# EAGLE design expansion_module_ARDUINO_UNO (EAGLE 9.6.2)
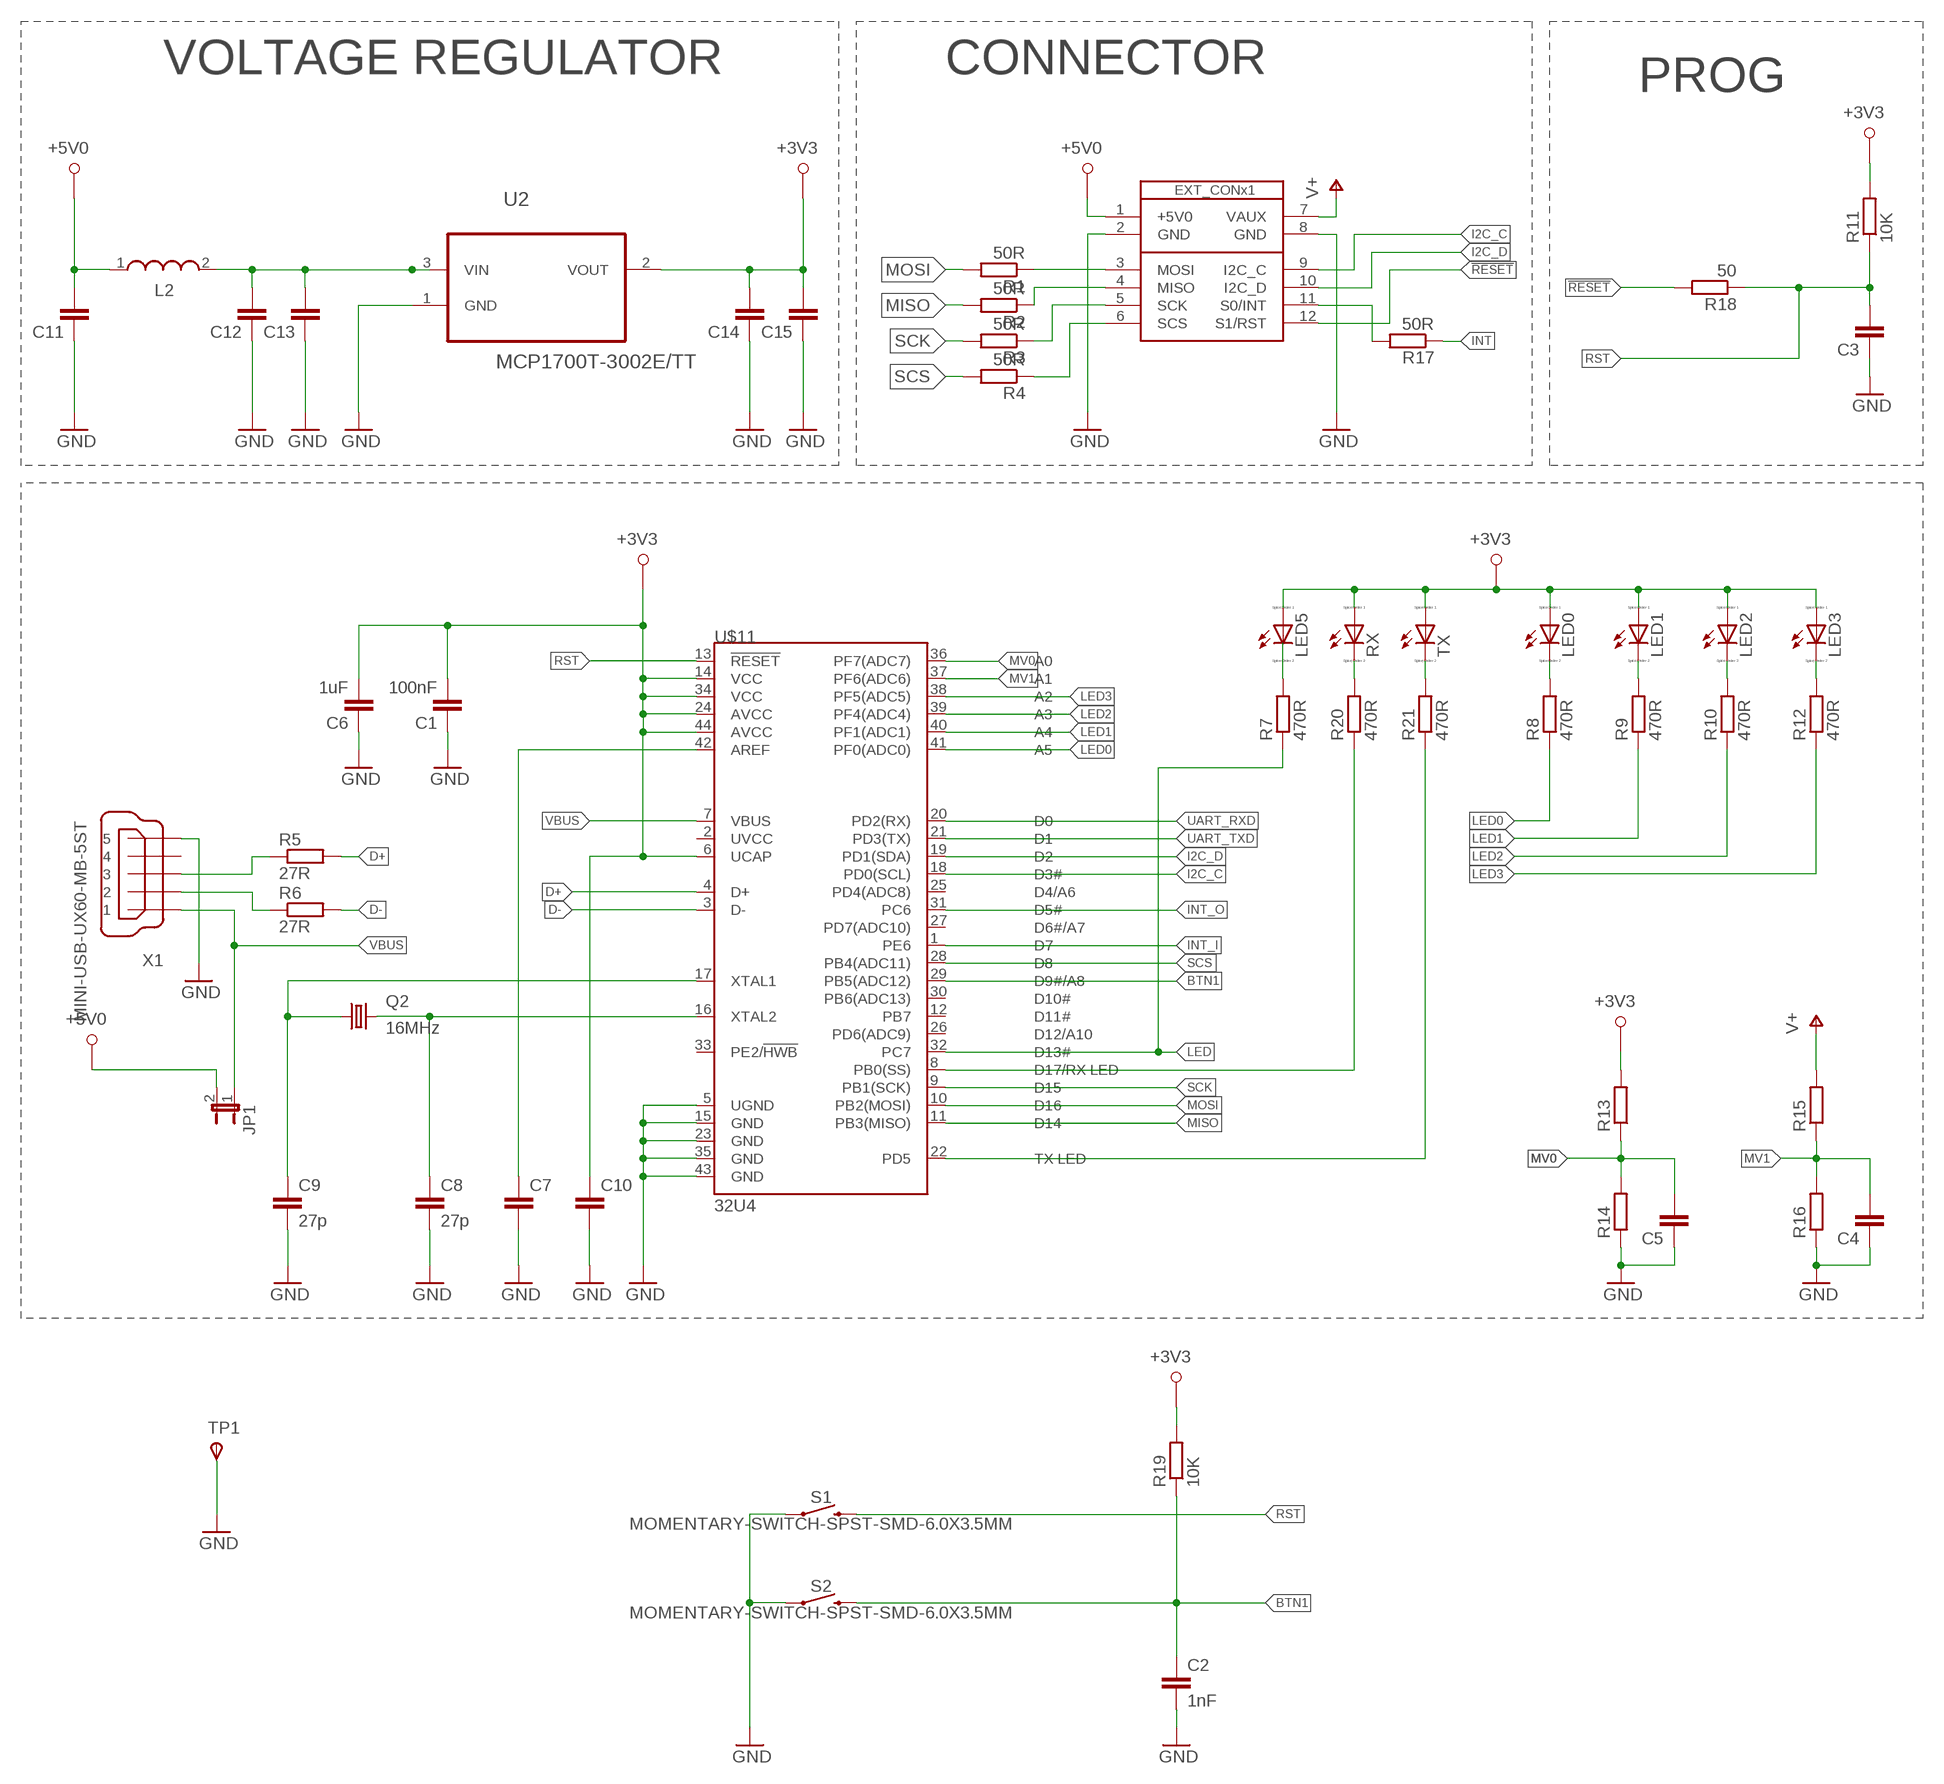
[diagram p0: schematic, sheet 1]

## Parts
C1  100nF  C-EUC0603  [C0603]
C2  1nF  C-EUC0603K  [C0603K]
C3  C-EUC0603  [C0603]
C4  C-EUC0603  [C0603]
C5  C-EUC0603  [C0603]
C6  1uF  C-EUC0603  [C0603]
C7  C-EUC0603K  [C0603K]
C8  27p  C-EUC0603K  [C0603K]
C9  27p  C-EUC0603K  [C0603K]
C10  C-EUC0603K  [C0603K]
C11  C-EUC0603  [C0603]
C12  C-EUC0603  [C0603]
C13  C-EUC0603  [C0603]
C14  C-EUC0603  [C0603]
C15  C-EUC0603  [C0603]
JP1  JP1E  [JP1]
L2  WE-LQ_1210  [WE-LQ_M]
LED0  LED_ESML0603  [LED_SML0603]
LED1  LED_ESML0603  [LED_SML0603]
LED2  LED_ESML0603  [LED_SML0603]
LED3  LED_ESML0603  [LED_SML0603]
LED5  LED_ESML0603  [LED_SML0603]
Q2  16MHz  KX-9A  [5.0X3.2_KX-9A]
R1  50R  R-EU_R0603  [R0603]
R2  50R  R-EU_R0603  [R0603]
R3  50R  R-EU_R0603  [R0603]
R4  50R  R-EU_R0603  [R0603]
R5  27R  R-EU_R0603  [R0603]
R6  27R  R-EU_R0603  [R0603]
R7  470R  R-EU_R0603  [R0603]
R8  470R  R-EU_R0603  [R0603]
R9  470R  R-EU_R0603  [R0603]
R10  470R  R-EU_R0603  [R0603]
R11  10K  R-EU_R0603  [R0603]
R12  470R  R-EU_R0603  [R0603]
R13  R-EU_R0603  [R0603]
R14  R-EU_R0603  [R0603]
R15  R-EU_R0603  [R0603]
R16  R-EU_R0603  [R0603]
R17  50R  R-EU_R0603  [R0603]
R18  50  R-EU_R0603  [R0603]
R19  10K  R-EU_R0603  [R0603]
R20  470R  R-EU_R0603  [R0603]
R21  470R  R-EU_R0603  [R0603]
RX  LED_ESML0603  [LED_SML0603]
S1  MOMENTARY-SWITCH-SPST-SMD-6.0X3.5MM  [TACTILE_SWITCH_SMD_6.0X3.5MM]
S2  MOMENTARY-SWITCH-SPST-SMD-6.0X3.5MM  [TACTILE_SWITCH_SMD_6.0X3.5MM]
TP1  TPSPAD1-13  [P1-13]
TX  LED_ESML0603  [LED_SML0603]
U2  MCP1700T-3002E/TT  [SOT95P237X112-3N]
U$1  SB_EXT_CON_X1_SPI  [SB_EXT_CON_X1_FULL]
U$11  32U4  ATMEGA32U4TQFP-44  [TQFP44]
X1  MINI-USB-UX60-MB-5ST  [UX60-MB-5ST]

## Nets
!RESET: R18.2 U$1.12(S1/RST)
+3V3: C1.2 C6.2 C10.1 C14.2 C15.2 LED0.A LED1.A LED2.A LED3.A LED5.A R11.2 R13.2 R19.2 RX.A TX.A U2.2(VOUT) U$11.6(UCAP) U$11.14(VCC) U$11.24(AVCC) U$11.34(VCC) U$11.44(AVCC)
+5V0: C11.2 JP1.2 L2.1 U$1.1(+5V0)
BTN1: C2.1 R19.1 S2.2 U$11.29(PB5(ADC12))
D+: R5.2 U$11.4(D+)
D-: R6.2 U$11.3(D-)
GND: C1.1 C2.2 C3.1 C4.1 C5.1 C6.1 C7.2 C8.2 C9.2 C10.2 C11.1 C12.1 C13.1 C14.1 C15.1 R14.1 R16.1 S1.1 S2.1 TP1.TP(PP) U2.1(GND) U$1.2(GND) U$1.8(GND) U$11.5(UGND) U$11.15(GND) U$11.23(GND) U$11.35(GND) U$11.43(GND) X1.5
I2C_C: U$1.9(I2C_C) U$11.18(PD0(SCL))
I2C_D: U$1.10(I2C_D) U$11.19(PD1(SDA))
INT: R17.1
INT_I: U$11.1(PE6)
INT_O: U$11.31(PC6)
LED: R7.1 U$11.32(PC7)
LED0: R8.1 U$11.41(PF0(ADC0))
LED1: R9.1 U$11.40(PF1(ADC1))
LED2: R10.1 U$11.39(PF4(ADC4))
LED3: R12.1 U$11.38(PF5(ADC5))
MISO: R2.2 U$11.11(PB3(MISO))
MOSI: R1.2 U$11.10(PB2(MOSI))
MV0: C5.2 R13.1 R14.2 U$11.36(PF7(ADC7))
MV1: C4.2 R15.1 R16.2 U$11.37(PF6(ADC6))
N$1: R1.1 U$1.3(MOSI)
N$2: R2.1 U$1.4(MISO)
N$3: R3.1 U$1.5(SCK)
N$4: R4.1 U$1.6(SCS)
N$5: LED5.C R7.2
N$7: C7.1 U$11.42(AREF)
N$8: R20.1 U$11.8(PB0(SS))
N$9: C9.1 Q2.1 U$11.17(XTAL1)
N$11: C8.1 Q2.3 U$11.16(XTAL2)
N$12: LED0.C R8.2
N$18: LED1.C R9.2
N$19: R6.1 X1.2
N$20: R5.1 X1.3
N$21: LED2.C R10.2
N$22: LED3.C R12.2
N$23: R21.1 U$11.22(PD5)
N$24: R21.2 TX.C
N$25: R20.2 RX.C
N$26: C12.2 C13.2 L2.2 U2.3(VIN)
N$27: R17.2 U$1.11(S0/INT)
RST: C3.2 R11.1 R18.1 S1.2 U$11.13(!RESET)
SCK: R3.2 U$11.9(PB1(SCK))
SCS: R4.2 U$11.28(PB4(ADC11))
UART_RXD: U$11.20(PD2(RX))
UART_TXD: U$11.21(PD3(TX))
V+: R15.2 U$1.7(VAUX)
VBUS: JP1.1 U$11.7(VBUS) X1.1
Unconnected: U$11.2(UVCC) U$11.12(PB7) U$11.25(PD4(ADC8)) U$11.26(PD6(ADC9)) U$11.27(PD7(ADC10)) U$11.30(PB6(ADC13)) U$11.33(PE2/!HWB) X1.4

## Notes on the sheet
- VOLTAGE REGULATOR | CONNECTOR
- PROG

## Library data of the parts
C1 C3-C6 C11-C15 = resistor:C-EU: CAPACITOR, European symbol
C2 C7-C10 = rcl:C-EU: CAPACITOR, European symbol
JP1 = jumper:JP1E: JUMPER
L2 = EagleLibrary_Wuerth_Elektronik_eiSos_rev16a:WE-LQ: SMD Inductor Characteristics Miniature chip inductor wound on a special ferrite core Small inductances for compact circuits High Q at high frequencies Low DC-resistance Operating temperature: –40 ºC to +125 ºC Applications Low power DC/DC-converters from Linear Technology, National Semiconductor, Texas Instruments, Fairchild Semiconductor, ON Semiconductor, STMicroelectronics, Maxim, MPS, Semtech, Exar, Analogic Tech, Diodes and Cologne Chip EMI-Filtering RF-circuits <http://katalog.we-online.de/media/images/eisos/IndLQ_pf2.jpg> Details see: http://katalog.we-online.de/en/pbs/WE-LQ? Updated by Dan Xu 2014-07-08 2014 (C) Wurth Elektronik
LED0 LED1-LED3 LED5 RX TX = eagle-ltspice:LED_E: LED Source: http://www.osram.convergy.de Source: www.luxeon.com Source: www.kingbright.com; SPICEMODEL: NONE; SPICEPREFIX: D; SPICETYPE: diode
Q2 = crystal-geyer_V1_0:KX: Quartz Crystals (MHz) SMD: KX - Serie Model Size l/w/h [mm] Frequency Range Frequency Stability Temp. Range [°C] Load Capacitance AECQ 200 availabel Datasheet KX-4 KX-5 KX-6 KX-7 KX-9A KX-9B KX-12A KX-12B KX-13 KX-20 KX-K KX-KS 1.6/1.2/0.3 2.0/1.6/0.45 2.5/2.0/0.55 3.2/2.5/0.8 5.0/3.2/1.0 5.0/3.2/1.1 6.0/3.5/1.1 6.0/3.5/1.0 7.0/5.0 /1.3 11.6/5.5/1.6 12.3/4.5/4.2 12.3/4.5/3.2 24.0 ~ 80.0 MHz 16.0 ~ 80.0 MHz 12.0 ~ 80.0 MHz 8.0 ~ 60.0 MHz 7,68 ~ 300,0 MHz 8,0 ~ 50,0 MHz 8,0 ~ 150,0 MHz 8,0 ~ 50,0 MHz 6,0 ~ 160,0 MHz 3,579 ~ 25,0 MHz 3,579 ~ 70,0 MHz 3,579 ~ 70,0 MHz ±10 … ±50ppm ±10 … ±50ppm ±10 … ±50ppm ±10 … ±50ppm ±10 … ±50ppm ±10 … ±50ppm ±10 … ±50ppm ±10 … ±50ppm ±10 … ±50ppm ±50ppm ±10 … ±50ppm ±10 … ±50ppm (*) -40°C …+85°C (*) -40°C …+125°C (*) -40°C …+125°C (*) -40°C …+125°C (*) -40°C …+105°C (*) -40°C …+105°C (*) -40°C …+125°C (*) -40°C …+105°C (*) -40°C …+105°C (*) -40°C …+105°C (*) -40°C …+85°C (*) -40°C …+85°C 8, 8…16 8, 8…16 10, 8…16 12, 7…20 16, 10…20 16, 10…20 16, 10…20 16, 12…20 16, 12…20 16, 12…20 16, 12…30 16, 12…30 - yes yes yes - - - - - - - - KX-4.pdf <http://www.geyer-electronic.de/uploads/tx_userartikelfrequenz/GEYER-KX-4.pdf> KX-5.pdf <http://www.geyer-electronic.de/uploads/tx_userartikelfrequenz/GEYER-KX-5.pdf> KX-6.pdf <http://www.geyer-electronic.de/uploads/tx_userartikelfrequenz/GEYER-KX-6.pdf> KX-7.pdf <http://www.geyer-electronic.de/uploads/tx_userartikelfrequenz/GEYER-KX-7.pdf> KX-9A.pdf <http://www.geyer-electronic.de/uploads/tx_userartikelfrequenz/GEYER-KX-9A.pdf> KX-9B.pdf <http://www.geyer-electronic.de/uploads/tx_userartikelfrequenz/GEYER-KX-9B.pdf> KX-12A.pdf <http://www.geyer-electronic.de/uploads/tx_userartikelfrequenz/GEYER-KX-12A.pdf> KX-12B.pdf <http://www.geyer-electronic.de/uploads/tx_userartikelfrequenz/GEYER-KX-12B.pdf> KX-13.pdf <http://www.geyer-electronic.de/uploads/tx_userartikelfrequenz/GEYER-KX-13.pdf> KX-20.pdf <http://www.geyer-electronic.de/uploads/tx_userartikelfrequenz/GEYER-KX-20.pdf> KX-K.pdf <http://www.geyer-electronic.de/uploads/tx_userartikelfrequenz/GEYER-KX-K.pdf> KX-KS.pdf <http://www.geyer-electronic.de/uploads/tx_userartikelfrequenz/GEYER-KX-KS.pdf> <http://www.geyer-electronic.de/fileadmin/template/img/logo-geyer-electronic.png> Details see: http://www.geyer-electronic.de/Frequenz-Produkte.9.0.html Created 2016-06-07, Hans Locher 2016 (C) Geyer Quartz Technology KX4,KX5,KX6,KX7,KX9A,KX9B,KX12A,KX12B,KX13,KX20,KXK,KXKS;1612;2016;2520;3225;5032;6035;7050;11655;12345;1,6x1,2;2,0x1,6;2,5x2,0;3,2x2,5;5,0x3,2;6,0x3,5;7,0x5,0;11,6x5,5;12,3x4,5;12,3x4,5;1.6x1.2;2.0x1.6;2.5x2.0;3.2x2.5;5.0x3.2;6.0x3.5;7.0x5.0;11.6x5.5;12.3x4.5;12.3x4.5;
R1-R21 = rcl:R-EU_: RESISTOR, European symbol
S1 S2 = SparkFun-Switches:MOMENTARY-SWITCH-SPST: Momentary Switch (Pushbutton) - SPST Normally-open (NO) SPST momentary switches (buttons, pushbuttons). Variants PTH-12MM - 12mm square, through-hole Momentary Pushbutton Switch - 12mm Square <https://www.sparkfun.com/products/9190> (COM-09190) PTH-6.0MM, PTH-6.0MM-KIT - 6.0mm square, through-hole Mini Pushbutton Switch <https://www.sparkfun.com/products/97> (COM-00097) KIT package intended for soldering kit's - only one side of pads' copper is exposed. PTH-RIGHT-ANGLE-KIT - Right-angle, through-hole Right Angle Tactile Button <https://www.sparkfun.com/products/10791> - Used on SparkFun BigTime Watch Kit <https://www.sparkfun.com/products/11734> SMD-12MM - 12mm square, surface-mount Tactile Button - SMD (12mm) <https://www.sparkfun.com/products/12993> (COM-12993) Used on SparkFun PicoBoard <https://www.sparkfun.com/products/11888> SMD-4.5MM - 4.5mm Square Trackball Switch Used on SparkFun Blackberry Trackballer Breakout <https://www.sparkfun.com/products/13169> SMD-4.6MMX2.8MM - 4.60mm x 2.80mm, surface mount Used on SparkFun SAMD21 Mini Breakout <https://www.sparkfun.com/products/13664> SMD-5.2MM, SMD-5.2-REDUNDANT - 5.2mm square, surface-mount Mini Pushbutton Switch - SMD <https://www.sparkfun.com/products/8720> (COM-08720) Used on Arduino Pro Mini <https://www.sparkfun.com/products/11114> REDUNDANT package connects both switch circuits together SMD-6.0X3.5MM - 6.0 x 3.5mm, surface mount Momentary Reset Switch SMD <https://www.sparkfun.com/products/8229> (COM-08229) SMD-6.2MM-TALL - 6.2mm square, surface mount Tactile Button - SMD (6mm) <https://www.sparkfun.com/products/12992> Used on SparkFun Digital Sandbox <https://www.sparkfun.com/products/12651> SMD-RIGHT-ANGLE - Right-angle, surface mount Used on SparkFun Block for Intel® Edison - Arduino <https://www.sparkfun.com/products/13036>; PROD_ID: SWCH-00815; SF_SKU: COM-08229
TP1 = testpad:TPS: TEST PIN
U2 = Microchip_By_element14_Batch_1:MCP1700T-3002E/TT: Low Quiescent Current LDO; MPN: MCP1700T-3002E/TT; OC_FARNELL: 1331482; OC_NEWARK: 84R5176; PACKAGE: SOT23-3; SUPPLIER: Microchip
U$1 = al_smartboard:SB_EXT_CON_X1_SPI
U$11 = SparkFun-IC-Microcontroller:ATMEGA32U4: Atmel MCU, 32KByte Atmel 44-pin 8-bit Microcontroller with 32KBytes of ISP Flash and USB Controller Datasheet <http://cdn.sparkfun.com/datasheets/Dev/Arduino/Boards/ATMega32U4.pdf> SparkFun Products LilyPad Arduino USB - ATmega32U4 Board <https://www.sparkfun.com/products/12049> (DEV-12049) Pro Micro - 5V/16MHz <https://www.sparkfun.com/products/12640> (DEV-12640) Pro Micro - 3.3V/8MHz <https://www.sparkfun.com/products/12587> (DEV-12587) Fio v3 - ATmega32U4 <https://www.sparkfun.com/products/11520> (DEV-11520) Qduino Mini <https://www.sparkfun.com/products/13614> (DEV-13614) Makey Makey - Standard Kit <https://www.sparkfun.com/products/11511> (WIG-11511) Makey Makey Deluxe Kit <https://www.sparkfun.com/products/11519> (WIG-11519); PROD_ID: IC-11161
X1 = con-hirose:MINI-USB-: MINI USB Connector Source: http://www.hirose.co.jp/cataloge_hp/e24000019.pdf; OC_FARNELL: unknown; OC_NEWARK: unknown

## Net classes
0 default: clearance 0.205 mm

## Board
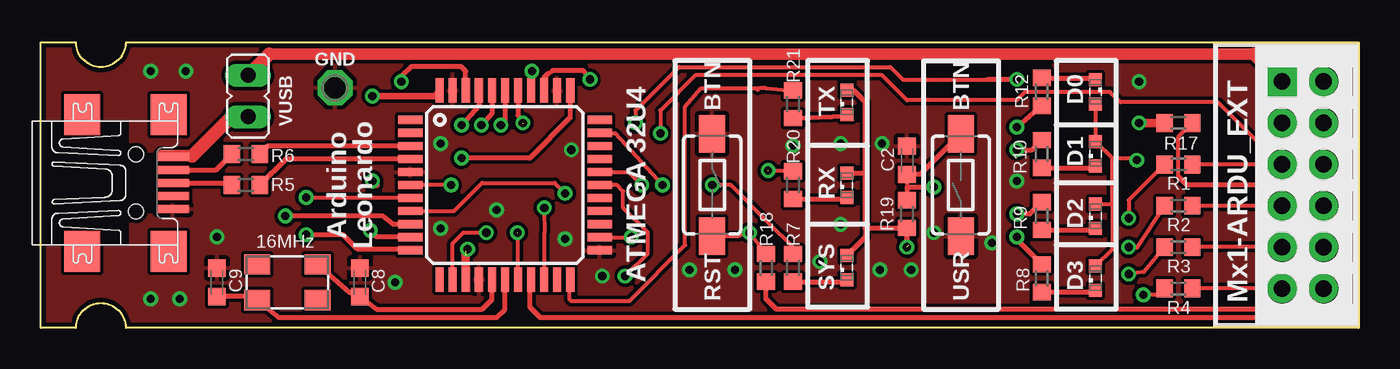
[diagram p1: board, top side]
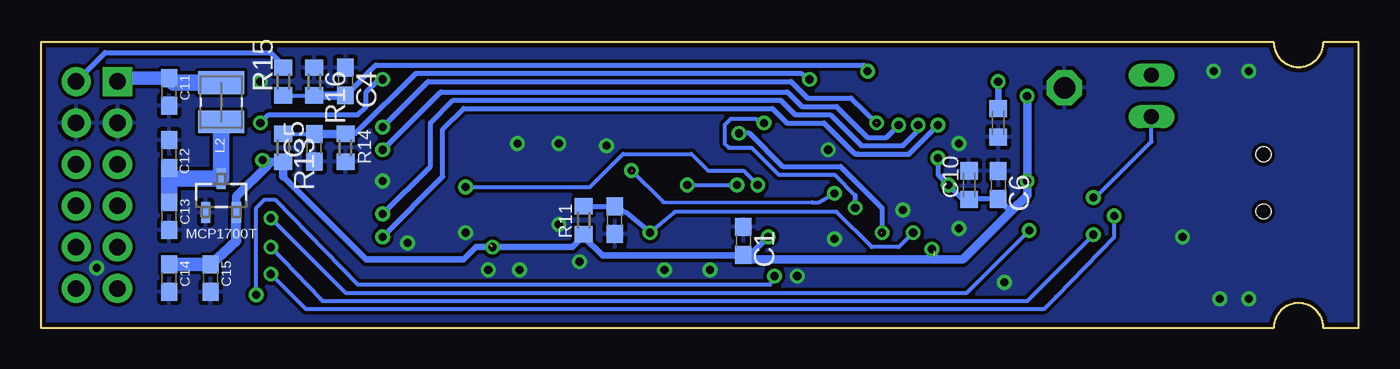
[diagram p2: board, bottom side, seen from below]

Size 80.77 x 17.53 mm. Coordinates in mm from the lower left corner, seen from the top.
Copper layers (1*16): Top 0.035mm / dielectric 1.5mm / Bottom 0.035mm
Design rules "smartboard *": minimum track width 10mil, minimum drill 15mil, track to track 8mil, track to pad 8mil, pad to pad 8mil, via to via 8mil, smd to smd 8mil, copper to edge 10mil, drill to drill 10mil, minimum pad ring 10mil, minimum via ring 8mil, stop-mask expansion 4mil, vias tented up to drill 20mil, thermal gap 10mil

### Footprints (pad centres in the part's own frame; a part is rotated, then mirrored left to right if it is on the bottom)
C0603 = smd 1.1 x 1: 1 -0.85,0; 2 0.85,0
C0603K = smd 1.05 x 1.08: 1 -0.875,0; 2 0.875,0
JP1 = drill 0.914 long: 1 0,-1.27; 2 0,1.27
WE-LQ_M = smd 1.4 x 2.8: 1 -1.2,0; 2 1.2,0
LED_SML0603 = smd 0.8 x 0.8: A 0.75,0; C -0.75,0
5.0X3.2_KX-9A = smd 1.6 x 1.25: 1 -1.85,-1.1; 2 1.85,-1.1; 3 1.85,1.1; 4 -1.85,1.1
R0603 = smd 1 x 1.1: 1 -0.85,0; 2 0.85,0
TACTILE_SWITCH_SMD_6.0X3.5MM = smd 2.3 x 1.6: 1 -3.15,0; 2 3.15,0
P1-13 = drill 1.321 pad 2.159 octagon: TP 0,0
SOT95P237X112-3N = smd 0.559 x 1.27: 1 -0.94,-1.041; 2 0.94,-1.041; 3 0,1.041
SB_EXT_CON_X1_FULL = drill 1 pad 1.778 square: 1 15.24,5.08 | drill 1 pad 1.778: 2 12.7,5.08; 3 10.16,5.08; 4 7.62,5.08; 5 5.08,5.08; 6 2.54,5.08; 7 15.24,2.54; 8 12.7,2.54; 9 10.16,2.54; 10 7.62,2.54; 11 5.08,2.54; 12 2.54,2.54
TQFP44 = smd 1.5 x 0.5: 1 -5.8,4; 2 -5.8,3.2; 3 -5.8,2.4; 4 -5.8,1.6; 5 -5.8,0.8; 6 -5.8,0; 7 -5.8,-0.8; 8 -5.8,-1.6; 9 -5.8,-2.4; 10 -5.8,-3.2; 11 -5.8,-4; 23 5.8,-4; 24 5.8,-3.2; 25 5.8,-2.4; 26 5.8,-1.6; 27 5.8,-0.8; 28 5.8,0; 29 5.8,0.8; 30 5.8,1.6; 31 5.8,2.4; 32 5.8,3.2; 33 5.8,4 | smd 0.5 x 1.5: 12 -4,-5.8; 13 -3.2,-5.8; 14 -2.4,-5.8; 15 -1.6,-5.8; 16 -0.8,-5.8; 17 0,-5.8; 18 0.8,-5.8; 19 1.6,-5.8; 20 2.4,-5.8; 21 3.2,-5.8; 22 4,-5.8; 34 4,5.8; 35 3.2,5.8; 36 2.4,5.8; 37 1.6,5.8; 38 0.8,5.8; 39 0,5.8; 40 -0.8,5.8; 41 -1.6,5.8; 42 -2.4,5.8; 43 -3.2,5.8; 44 -4,5.8
UX60-MB-5ST = smd 2 x 0.5: 1 2.25,1.6; 2 2.25,0.8; 3 2.25,0; 4 2.25,-0.8; 5 2.25,-1.6 | smd 2.2 x 2.5: M1 -3.3,-4.2; M2 -3.3,4.2; M3 2,4.2; M4 2,-4.2 | hole 0.9: 0,-1.75; 0,1.75

### Placement (x,y rotation side)
C1  37.72,5.33 270 bottom
C2  53.09,10.29 90 top
C3  45.59,6.6 90 bottom
C4  62.1,15.11 270 bottom
C5  64.01,11.05 90 bottom
C6  22.1,8.76 270 bottom
C7  22.1,12.57 270 bottom
C8  19.56,2.79 90 top
C9  10.79,2.79 90 top
C10  23.88,8.76 90 bottom
C11  72.9,14.48 90 bottom
C12  72.9,10.67 270 bottom
C13  72.9,6.86 90 bottom
C14  72.9,3.05 90 bottom
C15  70.36,3.05 90 bottom
JP1  12.7,14.22 0 top
L2  69.72,13.84 270 bottom
LED0  64.64,3.05 90 top
LED1  64.64,6.86 90 top
LED2  64.64,10.67 90 top
LED3  64.64,14.48 270 top
LED5  49.4,3.68 90 top
Q2  15.11,2.79 0 top
R1  69.72,10.03 180 top
R2  69.72,7.49 180 top
R3  69.72,4.95 180 top
R4  69.72,2.41 180 top
R5  12.57,8.76 0 top
R6  12.57,10.67 0 top
R7  46.1,3.68 270 top
R8  61.34,3.05 270 top
R9  61.34,6.86 270 top
R10  61.34,10.67 270 top
R11  47.5,6.6 270 bottom
R12  61.34,14.48 90 top
R13  65.91,11.05 270 bottom
R14  62.1,11.05 90 bottom
R15  65.91,15.11 90 bottom
R16  64.01,15.11 270 bottom
R17  69.72,12.57 0 top
R18  44.45,3.68 270 top
R19  53.09,6.98 270 top
R20  46.1,8.76 270 top
R21  46.1,13.72 270 top
RX  49.4,8.76 90 top
S1  41.15,8.76 270 top
S2  56.39,8.76 90 top
TP1  18.03,14.73 0 top
TX  49.4,13.84 90 top
U2  69.72,8.13 0 bottom
U$1  81.15,-0.13 90 top
U$11  28.45,8.76 0 top
X1  5.84,8.89 0 top

### Tracks (layer width: path | path; a pad name or v marks a point on that pad's centre or on a via)
!RESET
  Top 0.305: U$1.12 78.61,2.16 77.6,1.14 45.08,1.14 44.45,1.78 R18.2
+3V3  (via drill 0.5)  (2 unrouted)
  Top 0.254: U$11.24 36.17,5.56 v36.2,5.59 | 65.66,10.41 LED2.A LED3.A | 65.66,7.62 65.66,10.41 | 65.66,7.62 65.66,4.81 LED0.A | LED1.A 65.65,7.61 65.66,7.62 | 65.66,10.41 67.06,10.41 v67.18,10.29 | v25.15,8.76 U$11.6
  Top 0.305: TX.A 49.8,14.59 50.55,13.84 50.55,9.5 | 50.55,6.07 50.55,9.5 | 50.55,6.07 50.55,5.58 LED5.A | RX.A 50.53,9.51 50.55,9.5 | 50.55,6.07 50.61,6.13 R19.2 53.09,5.21 53.21,5.08 | v53.09,4.95 53.09,5.71 53.21,5.84 | U$11.34 32.45,12.89 29.97,10.41 v25.78,10.41
  Top 0.406: 20.57,8.76 v20.32,9.02 | U$11.44 24.11,14.22 v20.32,14.22
  Top 0.508: U$11.14 26.05,4.71 v26.16,4.83
  Bottom 0.254: C1.2 37.72,4.2 37.73,4.19 | v67.18,10.29 67.18,10.27 66.87,9.96
  Bottom 0.305: 47.5,5.65 R11.2 | C6.2 23.85,7.91 C10.1 24.27,7.89 v25.15,8.76 25.78,9.4 v25.78,10.41
  Bottom 0.406: 65.91,9.27 60.83,4.19 54.86,4.19 54.1,4.95 v53.09,4.95 48.19,4.95 47.5,5.65 | C6.2 21.39,7.2 21.24,7.2 | v36.2,5.59 37.3,4.48 C1.2 37.76,4.44 46.35,4.44 47.5,5.59 R11.2
  Bottom 0.508: U2.2 68.78,8.05 66.87,9.96 66.67,10.16 65.95,10.16 R13.2 65.91,9.27 | 37.73,4.19 26.29,4.19 | 26.29,4.19 24.26,4.19 21.24,7.2 20.32,8.13 v20.32,9.02 v20.32,14.22 | 26.03,4.44 26.29,4.19
  Bottom 0.61: 72.52,3.9 C14.2 | U2.2 68.78,5.35 C15.2
  Bottom 0.813: C15.2 72.52,3.9
+5V0
  Top 0.711: 74.38,16.8 14.01,16.8
  Top 0.813: 75.56,15.62 U$1.1 74.38,16.8 | 14.01,16.8 JP1.2
  Bottom 0.813: U$1.1 75.86,15.33 C11.2
  Bottom 1.016: C11.2 72.61,15.04 L2.1
BTN1  (via drill 0.5)
  Top 0.254: C2.1 53.09,8.64 | U$11.29 36.03,9.56 v36.83,8.76
  Top 0.305: R19.1 53.09,8.64 v54.74,8.64 | C2.1 53.89,9.41 S2.2
  Bottom 0.254: v54.74,8.64 47.12,8.64 45.09,10.67 40.89,10.67 39.88,9.65 37.72,9.65 v36.83,8.76
D+
  Top 0.305: U$11.4 15.02,10.36 R5.2
D-
  Top 0.305: U$11.3 13.92,11.16 R6.2
GND  (via drill 0.5)
  other vias: 67.31,15.11 59.82,9.02 46.1,11.18 10.79,5.59 8.51,1.78 6.73,1.78 6.73,15.75 8.89,15.75 24.51,6.1 32.13,5.46 77.34,3.68 58.29,5.21 54.74,5.84 49.02,6.35 49.02,11.3 51.56,11.3 27.94,7.24 21.72,2.79 32.51,10.92 34.42,3.17 24.51,11.3 53.34,3.56 47.75,4.06 42.55,3.56 39.75,3.56 51.44,3.56
  pour Top: -0.13,17.65 81.15,17.65 81.15,-0.13 -0.13,-0.13
  pour Bottom: 19.43,17.53 81.79,17.65 81.79,-0.13 19.43,-0.25
  pour Bottom: 0,17.53 23.37,17.53 23.37,0 0,0
I2C_C  (via drill 0.5)  (1 unrouted)
  Top 0.254: U$1.9 77.34,11.3 74.68,11.3 72.14,13.84 66.17,13.84 65.53,14.48 60.33,14.48 59.82,13.97 53.09,13.97 51.56,15.49 40.13,15.49 37.97,13.33 v37.97,11.94 | 29.26,5.82 29.25,5.8 U$11.18
  Bottom 0.305: v37.97,11.94 37.34,11.94 35.31,9.91 31.75,9.91 29.21,7.37 v29.21,5.84
I2C_D
  Top 0.305: U$11.19 29.97,2.89 29.97,1.27 30.61,0.64 79.25,0.64 80.14,1.52 80.14,5.97 U$1.10
INT  (via drill 0.5)
  Top 0.254: 30.85,7.23 30.86,5.82 30.86,2.98 | 30.85,7.23 30.85,7.35 | 58.04,15.24 52.83,15.24 52.07,16 39.12,16 36.45,13.33 v36.45,12.57 | v30.86,7.37 30.86,7.24 30.85,7.23 | v59.82,15.24 59.65,15.24
  Top 0.305: 59.65,15.24 58.04,15.24
  Top 0.508: R17.1 v67.31,12.57
  Bottom 0.254: v36.45,12.57 36.96,12.83 38.48,12.83 38.86,12.45 38.86,11.3 38.61,11.05 37.21,11.05 35.56,9.4 32.13,9.4 30.86,8.13 | v59.82,15.24 60.07,15.24 60.2,15.11
  Bottom 0.305: v67.31,12.57 66.8,13.08 61.34,13.08 60.83,13.59 60.83,14.48 60.2,15.11 59.82,15.11 | 30.86,8.13 v30.86,7.37
LED  (via drill 0.5)
  Top 0.254: R7.1 46.1,4.95 44.58,6.48 44.45,6.6 42.29,8.76 v41.15,8.76 | U$11.32 34.27,11.94 35.18,11.94 v38.1,8.76
  Bottom 0.254: v41.15,8.76 v38.1,8.76
LED0  (via drill 0.5)
  Top 0.305: R8.1 59.82,5.42 v59.82,5.59 | U$11.41 26.85,13.64 v25.78,12.45
  Bottom 0.305: v59.82,5.59 56.13,9.27 56.13,12.19 54.87,13.46 35.94,13.46 35.05,12.57 32.76,12.57 30.86,10.67 30.69,10.67 30.69,10.66 27.56,10.66 v25.78,12.45
LED1  (via drill 0.5)
  Top 0.254: 27.69,14.53 U$11.40
  Top 0.305: R9.1 60.62,6.98 v59.82,6.98 | U$11.40 27.65,13.17 v27,12.45
  Bottom 0.305: v59.82,6.98 56.9,9.91 56.9,12.57 55.5,13.97 35.43,13.97 34.54,13.08 32.38,13.08 30.48,11.17 28.74,11.17 28.74,11.18 27.94,11.18 27.05,12.06 v27,12.45
LED2  (via drill 0.5)
  Top 0.254: 28.32,14.44 U$11.39 | v59.82,10.92 59.94,10.92
  Top 0.305: R10.1 60.75,10.92 59.94,10.92 | U$11.39 28.45,12.7 v28.19,12.45
  Bottom 0.305: v59.82,10.92 56.26,14.48 35.01,14.48 34.12,13.59 32,13.59 30.1,11.68 28.96,11.68 v28.19,12.45
LED3  (via drill 0.5)  (1 unrouted)
  Top 0.254: 29.21,14.53 U$11.38
  Top 0.305: R12.1 59.82,12.28 v59.82,12.32 | U$11.38 29.25,13.04 29.59,12.57
  Bottom 0.305: v59.82,12.32 57.03,15.11 34.79,15.11 33.78,14.1 31.12,14.1 v29.54,12.57
MISO  (via drill 0.5)
  Top 0.254: 68.83,7.11 68.83,7.45 R2.2 67.18,4.91 v66.67,4.95
  Top 0.305: U$11.11 22.59,4.83 19.43,4.83 18.54,5.71 v16.26,5.71
  Bottom 0.254: v66.67,4.95 63.63,1.78 63.5,1.65 20.32,1.65 v16.26,5.71
MOSI  (via drill 0.5)
  Top 0.254: R1.2 66.67,7.83 v66.67,6.73
  Top 0.305: U$11.10 22.62,5.59 20.57,5.59 v20.19,5.97
  Bottom 0.254: v20.19,5.97 24,2.16 62.1,2.16 v66.67,6.73
MV0  (via drill 0.5)
  Top 0.305: U$11.36 30.85,15.35 31.12,15.62 31.33,15.75 31.38,15.8 33.23,15.8 v33.66,15.24
  Bottom 0.254: R13.1 64.19,11.9 C5.2
  Bottom 0.305: R14.2 62.06,11.94 61.47,11.94 57.78,15.62 34.16,15.62 v33.66,15.24
  Bottom 0.508: 64.19,11.9 R14.2
MV1  (via drill 0.5)
  Top 0.254: U$11.37 30.1,14.61 v30.1,15.75
  Bottom 0.254: R15.1 64.03,14.26 R16.2 C4.2
  Bottom 0.305: C4.2 60.24,16.13 30.35,16.13 v30.1,15.75
  Bottom 0.508: C4.2 64.03,14.26
N$1
  Top 0.254: U$1.3 R1.1
N$2
  Top 0.254: U$1.4 R2.1
N$3
  Top 0.254: U$1.5 R3.1
N$4
  Top 0.254: U$1.6 R4.1
N$5
  Top 0.305: R7.2 49.3,2.83 LED5.C
N$7  (via drill 0.5)
  Top 0.305: U$11.42 26.03,14.58 26.03,15.75 25.74,16.04 22.73,16.04 22.1,15.4 v22.1,15.11
  Bottom 0.406: C7.1 v22.1,15.11
N$8  (via drill 0.5)  (1 unrouted)
  Top 0.254: R20.1 44.54,9.61 | U$11.8 25.32,7.16 27.05,8.89 31.5,8.89 v32.13,8.25
  Bottom 0.254: v44.58,9.65 42.62,7.72 33.5,7.7 33.07,7.7 v32.13,8.25
N$9
  Top 0.305: 13.04,2.17 Q2.1 | Q2.1 14.58,0.64 27.94,0.64 28.45,1.14 U$11.17 | Q2.1 13.04,1.92 C9.1
N$11
  Top 0.305: Q2.3 18.94,2.17 C8.1 20.59,1.14 27.05,1.14 27.65,1.74 U$11.16
N$12
  Top 0.305: R8.2 64.54,2.2 LED0.C
N$15
  Top 0.508: 9.27,10.67 7.37,10.67
N$18
  Top 0.305: R9.2 64.54,6.01 LED1.C
N$19
  Top 0.305: X1.2 10.75,9.69 R6.1
N$20
  Top 0.305: X1.3 11.6,8.89 R5.1
N$21
  Top 0.305: R10.2 64.54,9.82 LED2.C
N$22
  Top 0.305: R12.2 64.54,15.33 LED3.C
N$23
  Top 0.254: R21.1 44.46,14.69 44.03,14.69 | 44.03,14.69 43.94,14.6 | U$11.22 32.38,2.9 32.38,1.78 32.51,1.65 36.07,1.65 39.5,5.08 39.5,13.59 40.47,14.69 44.03,14.69
N$24
  Top 0.305: R21.2 49.3,12.99 TX.C
N$25
  Top 0.305: R20.2 49.3,7.91 RX.C
N$26
  Bottom 1.016: L2.2 U2.3 72.8,9.17 72.9,9.27 | 72.9,9.27 C12.2 | 72.9,9.27 C13.2
N$27
  Top 0.254: 69.72,9.27 69.72,11.72 R17.2
  Top 0.305: U$1.11 77.34,6.22 77.34,8.38 76.96,8.76 70.23,8.76 69.72,9.27
RST  (via drill 0.5)
  Top 0.254: S1.2 42.73,5.61 43.39,5.84 | 43.39,5.84 R18.1 | U$11.13 25.25,5.18 25.91,5.84 v27.3,5.84 27.43,5.84 | v43.43,5.84 43.39,5.84
  Bottom 0.254: v27.3,5.84 28.19,4.95 29.84,4.95 32,7.11 41.91,7.11 v43.43,5.84
  Bottom 0.305: R11.1 C3.2 44.92,7.07 v43.43,5.84
SCK  (via drill 0.5)
  Top 0.254: R3.2 67.6,3.43 v66.67,3.3
  Top 0.305: U$11.9 22.63,6.35 21.59,6.35 20.95,6.86 v14.99,6.86
  Bottom 0.254: v14.99,6.86 14.99,5.59 18.54,1.91 19.3,1.14 64.52,1.14 v66.67,3.3
SCS  (via drill 0.5)
  Top 0.254: R4.2 68.62,2.03 v67.56,2.03 | v35.81,3.17 37.21,4.57 37.21,5.84 35.69,7.37 35.69,8.38 35.31,8.76 U$11.28
  Bottom 0.254: v35.81,3.17 36.07,2.67 61.34,2.67 66.42,7.87 67.06,7.87 67.56,7.37 v67.56,2.03
V+
  Bottom 0.305: U$1.7 76.83,16.89 66.67,16.89 65.91,16.13 R15.2
VBUS  (via drill 0.5)
  Top 0.254: X1.1 9.09,10.49 9.14,10.54 | 16.22,7.96 U$11.7 22.61,8 v16.26,8
  Top 0.305: 9.22,10.49 X1.1
  Top 0.508: 9.14,10.54 9.27,10.54 9.65,10.92
  Top 0.813: JP1.1 11.68,12.95 9.65,10.92 9.28,10.55
  Bottom 0.254: v16.26,8 16.13,8 12.7,11.43 JP1.1

### Text on the board
tPlace: GND | VUSB | BTN | BTN | D0 | D1 | Arduino / Leonardo | 16MHz | D2 | ATMEGA 32U4 | SYS | D3 | RST | USR
tNames: Mx1-ARDU_EXT
bNames: MCP1700T